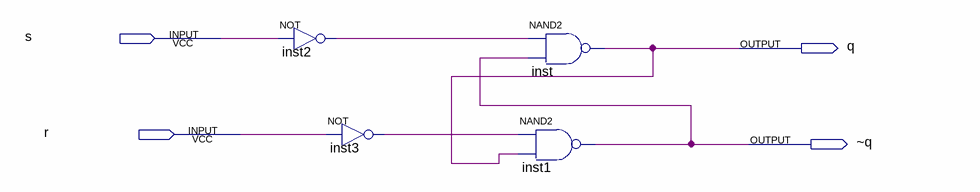
[diagram p0: schematic sheet]
// Quartus schematic step1b.bdf as structural Verilog: 4 symbols, 4 pins
module step1b (
  input  s,
  input  r,
  output q,
  output \~q 
);

  wire inst2_out, inst3_out;

  not inst2 (inst2_out, s);
  not inst3 (inst3_out, r);
  nand inst (q, inst2_out, \~q );
  nand inst1 (\~q , inst3_out, q);
endmodule
